# Altium schematic sheet MAIN_POWER.SchDoc: MAIN POWER & SUBSHEETS
size A3; Date: 2011-11-28; Author: S.Choquette; Revision: 2.0; SheetNumber: 1; SheetTotal: 9
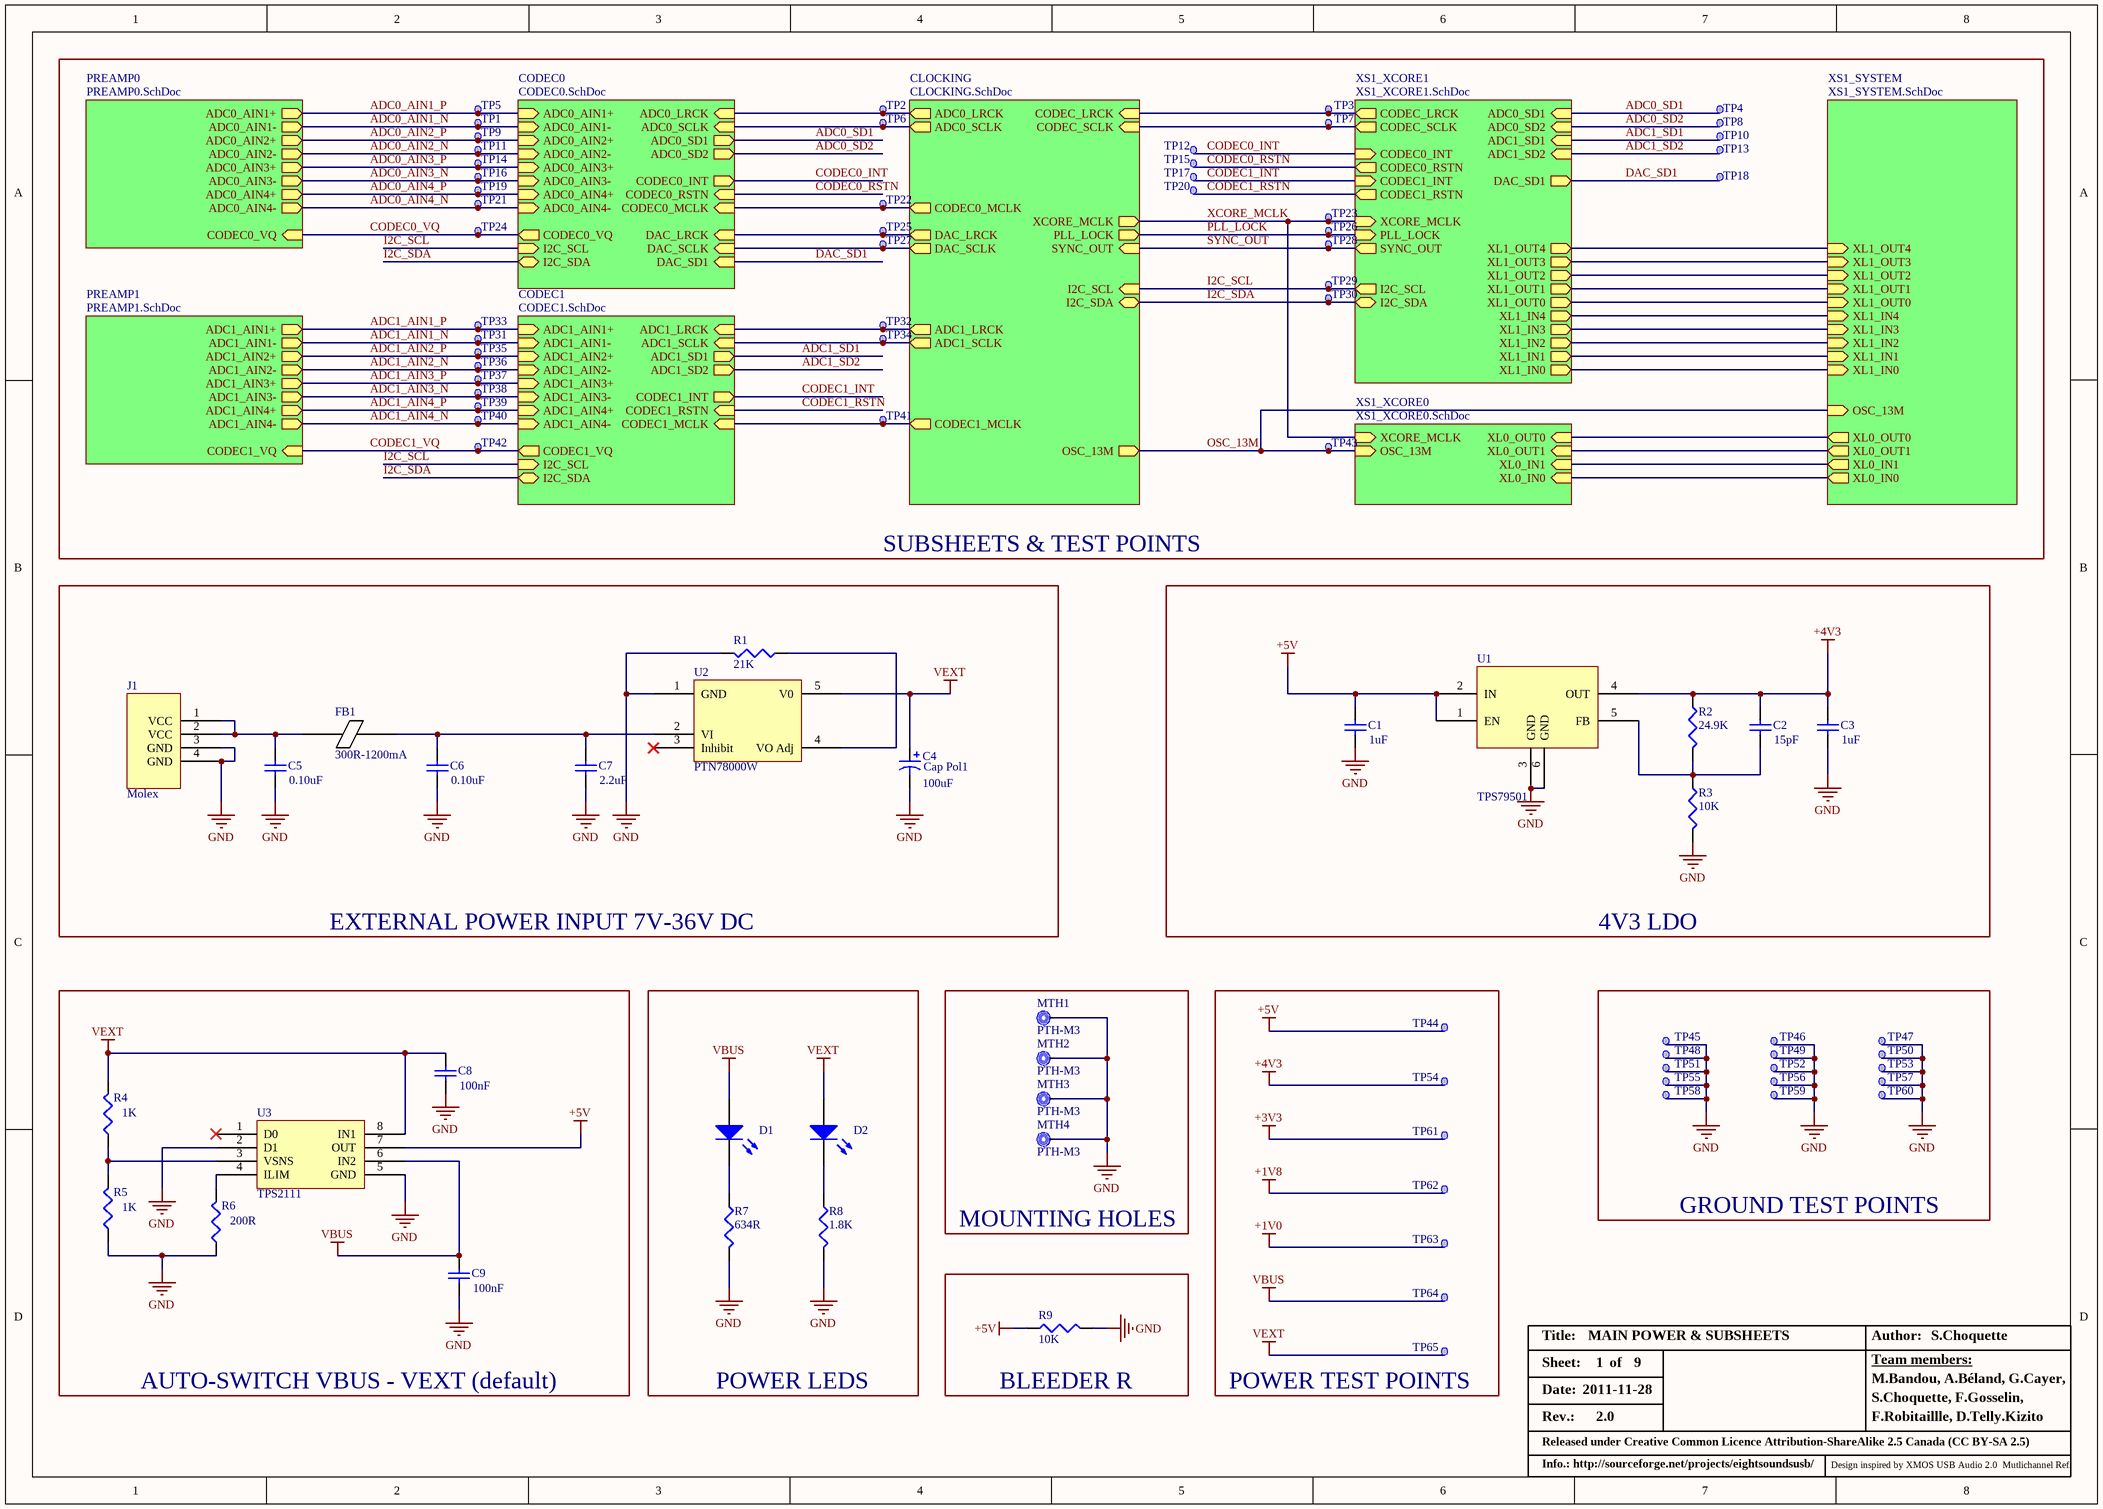
[diagram p0: MAIN_POWER.SchDoc]

## Parts
C1  value 1uF  [3-0603]
C2  value 15pF  [3-0603]
C3  value 1uF  [3-0603]
C4  Cap Pol1  value 100uF  [AL_ELEC_SMD_D]
C5  value 0.10uF  [3-0603]
C6  value 0.10uF  [3-0603]
C7  value 2.2uF  [8-1206]
C8  value 100nF  [3-0603]
C9  value 100nF  [3-0603]
D1  VBUS  [LED_0603]  (value not drawn)
D2  VEXT  [LED_0603]  (value not drawn)
FB1  300R-1200mA  [3-0603]
J1  Molex  [MOLEX-P4]
MTH1  PTH-M3  [Mounting Hole]
MTH2  PTH-M3  [Mounting Hole]
MTH3  PTH-M3  [Mounting Hole]
MTH4  PTH-M3  [Mounting Hole]
R1  value 21K  [3-0603]
R2  value 24.9K  [3-0603]
R3  value 10K  [3-0603]
R4  value 1K  [3-0603]
R5  value 1K  [3-0603]
R6  value 200R  [3-0603]
R7  value 634R  [3-0603]
R8  value 1.8K  [3-0603]
R9  value 10K  [3-0603]
TP1  TP  [TP]  (value not drawn)
TP2  TP  [TP]  (value not drawn)
TP3  TP  [TP]  (value not drawn)
TP4  TP  [TP]  (value not drawn)
TP5  TP  [TP]  (value not drawn)
TP6  TP  [TP]  (value not drawn)
TP7  TP  [TP]  (value not drawn)
TP8  TP  [TP]  (value not drawn)
TP9  TP  [TP]  (value not drawn)
TP10  TP  [TP]  (value not drawn)
TP11  TP  [TP]  (value not drawn)
TP12  TP  [TP]  (value not drawn)
TP13  TP  [TP]  (value not drawn)
TP14  TP  [TP]  (value not drawn)
TP15  TP  [TP]  (value not drawn)
TP16  TP  [TP]  (value not drawn)
TP17  TP  [TP]  (value not drawn)
TP18  TP  [TP]  (value not drawn)
TP19  TP  [TP]  (value not drawn)
TP20  TP  [TP]  (value not drawn)
TP21  TP  [TP]  (value not drawn)
TP22  TP  [TP]  (value not drawn)
TP23  TP  [TP]  (value not drawn)
TP24  TP  [TP]  (value not drawn)
TP25  TP  [TP]  (value not drawn)
TP26  TP  [TP]  (value not drawn)
TP27  TP  [TP]  (value not drawn)
TP28  TP  [TP]  (value not drawn)
TP29  TP  [TP]  (value not drawn)
TP30  TP  [TP]  (value not drawn)
TP31  TP  [TP]  (value not drawn)
TP32  TP  [TP]  (value not drawn)
TP33  TP  [TP]  (value not drawn)
TP34  TP  [TP]  (value not drawn)
TP35  TP  [TP]  (value not drawn)
TP36  TP  [TP]  (value not drawn)
TP37  TP  [TP]  (value not drawn)
TP38  TP  [TP]  (value not drawn)
TP39  TP  [TP]  (value not drawn)
TP40  TP  [TP]  (value not drawn)
TP41  TP  [TP]  (value not drawn)
TP42  TP  [TP]  (value not drawn)
TP43  TP  [TP]  (value not drawn)
TP44  TP  [TP]  (value not drawn)
TP45  TP  [TP]  (value not drawn)
TP46  TP  [TP]  (value not drawn)
TP47  TP  [TP]  (value not drawn)
TP48  TP  [TP]  (value not drawn)
TP49  TP  [TP]  (value not drawn)
TP50  TP  [TP]  (value not drawn)
TP51  TP  [TP]  (value not drawn)
TP52  TP  [TP]  (value not drawn)
TP53  TP  [TP]  (value not drawn)
TP54  TP  [TP]  (value not drawn)
TP55  TP  [TP]  (value not drawn)
TP56  TP  [TP]  (value not drawn)
TP57  TP  [TP]  (value not drawn)
TP58  TP  [TP]  (value not drawn)
TP59  TP  [TP]  (value not drawn)
TP60  TP  [TP]  (value not drawn)
TP61  TP  [TP]  (value not drawn)
TP62  TP  [TP]  (value not drawn)
TP63  TP  [TP]  (value not drawn)
TP64  TP  [TP]  (value not drawn)
TP65  TP  [TP]  (value not drawn)
U1  TPS79501  [SOT223-6L]
U2  PTN78000W  [PTN78000W]
U3  TPS2111  [TSOP65P640-8AL]

## Blocks framed on the sheet
SUBSHEETS & TEST POINTS: TP1-TP43
EXTERNAL POWER INPUT 7V-36V DC: C4-C7 FB1 J1 R1 U2
4V3 LDO: C1-C3 R2 R3 U1
AUTO-SWITCH VBUS - VEXT (default): C8 C9 R4-R6 U3
POWER LEDS: D1 D2 R7 R8
MOUNTING HOLES: MTH1-MTH4
POWER TEST POINTS: TP44 TP54 TP61-TP65
GROUND TEST POINTS: TP45-TP53 TP55-TP60
BLEEDER R: R9

## Sub-sheets
CLOCKING = CLOCKING.SchDoc: SYNC_OUT (in), CODEC0_MCLK (out), CODEC1_MCLK (out), I2C_SCL (in), I2C_SDA (bidir), PLL_LOCK (out), OSC_13M (out), CODEC_LRCK (in), CODEC_SCLK (in), ADC0_SCLK (out), ADC0_LRCK (out), DAC_SCLK (out), DAC_LRCK (out), XCORE_MCLK (out), ADC1_LRCK (out), ADC1_SCLK (out)
CODEC0 = CODEC0.SchDoc: ADC0_AIN1+ (in), ADC0_AIN1- (in), ADC0_AIN2+ (in), ADC0_AIN2- (in), ADC0_AIN3+ (in), ADC0_AIN3- (in), ADC0_AIN4+ (in), ADC0_AIN4- (in), CODEC0_VQ (out), ADC0_LRCK (in), ADC0_SCLK (in), ADC0_SD1 (out), ADC0_SD2 (out), CODEC0_INT (out), CODEC0_RSTN (in), CODEC0_MCLK (in), DAC_LRCK (in), DAC_SCLK (in), DAC_SD1 (in), I2C_SCL (in), I2C_SDA
CODEC1 = CODEC1.SchDoc: ADC1_AIN1+ (in), ADC1_AIN1- (in), ADC1_AIN2+ (in), ADC1_AIN2- (in), ADC1_AIN3+ (in), ADC1_AIN3- (in), ADC1_AIN4+ (in), ADC1_AIN4- (in), CODEC1_VQ (out), ADC1_LRCK (in), ADC1_SCLK (in), ADC1_SD1 (out), ADC1_SD2 (out), CODEC1_INT (out), CODEC1_RSTN (in), CODEC1_MCLK (in), I2C_SCL (in), I2C_SDA (bidir)
PREAMP0 = PREAMP0.SchDoc: ADC0_AIN1+ (out), ADC0_AIN1- (out), ADC0_AIN2+ (out), ADC0_AIN2- (out), ADC0_AIN3+ (out), ADC0_AIN3- (out), ADC0_AIN4+ (out), ADC0_AIN4- (out), CODEC0_VQ (in)
PREAMP1 = PREAMP1.SchDoc: ADC1_AIN1+ (out), ADC1_AIN1- (out), ADC1_AIN2+ (out), ADC1_AIN2- (out), ADC1_AIN3+ (out), ADC1_AIN3- (out), ADC1_AIN4+ (out), ADC1_AIN4- (out), CODEC1_VQ (in)
XS1_SYSTEM = XS1_SYSTEM.SchDoc: XL0_OUT1 (out), XL0_OUT0 (out), XL0_IN0 (out), XL0_IN1 (out), XL1_OUT4 (in), XL1_OUT3 (in), XL1_OUT2 (in), XL1_OUT1 (in), XL1_OUT0 (in), XL1_IN4 (in), XL1_IN3 (in), XL1_IN2 (in), XL1_IN1 (in), XL1_IN0 (in), OSC_13M (in)
XS1_XCORE0 = XS1_XCORE0.SchDoc: XL0_IN0 (in), XL0_IN1 (in), XL0_OUT1 (in), XL0_OUT0 (in), OSC_13M (in), XCORE_MCLK (in)
XS1_XCORE1 = XS1_XCORE1.SchDoc: CODEC_LRCK (out), CODEC_SCLK (out), CODEC0_INT (in), CODEC0_RSTN (out), CODEC1_INT (in), CODEC1_RSTN (out), XCORE_MCLK (in), PLL_LOCK (in), SYNC_OUT (out), ADC0_SD1 (in), ADC0_SD2 (in), ADC1_SD1 (in), ADC1_SD2 (in), DAC_SD1 (out), I2C_SCL (out), I2C_SDA (bidir), XL1_OUT4 (out), XL1_OUT3 (out), XL1_OUT2 (out), XL1_OUT1 (out), XL1_OUT0 (out), XL1_IN4 (out), XL1_IN3 (out), XL1_IN2 (out), XL1_IN1 (out), XL1_IN0 (out)

## Nets
+1V0: TP63.1
+1V8: TP62.1
+3V3: TP61.1
+4V3: C2.2 C3.2 R2.1 TP54.1 U1.4(OUT)
+5V: C1.2 R9.1 TP44.1 U1.1(EN) U1.2(IN) U3.7(OUT)
GND: C1.1 C3.1 C4.2 C5.1 C6.1 C7.1 C8.1 C9.1 J1.3(GND) J1.4(GND) MTH1.1 MTH2.1 MTH3.1 MTH4.1 R1.2 R3.2 R5.1 R6.1 R7.2 R8.2 R9.2 TP45.1 TP46.1 TP47.1 TP48.1 TP49.1 TP50.1 TP51.1 TP52.1 TP53.1 TP55.1 TP56.1 TP57.1 TP58.1 TP59.1 TP60.1 U1.3(GND) U1.6(GND) U2.1(GND) U3.2(D1) U3.5(GND)
VBUS: C9.2 D1.1(A) TP64.1 U3.6(IN2)
VEXT: C4.1 C8.2 D2.1(A) R4.2 TP65.1 U2.5(V0) U3.8(IN1)
ADC0_AIN1_N: TP1.1 ; sheet CODEC0/ADC0_AIN1-, sheet PREAMP0/ADC0_AIN1-
ADC0_AIN1_P: TP5.1 ; sheet CODEC0/ADC0_AIN1+, sheet PREAMP0/ADC0_AIN1+
ADC0_AIN2_N: TP11.1 ; sheet CODEC0/ADC0_AIN2-, sheet PREAMP0/ADC0_AIN2-
ADC0_AIN2_P: TP9.1 ; sheet CODEC0/ADC0_AIN2+, sheet PREAMP0/ADC0_AIN2+
ADC0_AIN3_N: TP16.1 ; sheet CODEC0/ADC0_AIN3-, sheet PREAMP0/ADC0_AIN3-
ADC0_AIN3_P: TP14.1 ; sheet CODEC0/ADC0_AIN3+, sheet PREAMP0/ADC0_AIN3+
ADC0_AIN4_N: TP21.1 ; sheet CODEC0/ADC0_AIN4-, sheet PREAMP0/ADC0_AIN4-
ADC0_AIN4_P: TP19.1 ; sheet CODEC0/ADC0_AIN4+, sheet PREAMP0/ADC0_AIN4+
ADC0_SD1: TP4.1 ; sheet CODEC0/ADC0_SD1, sheet XS1_XCORE1/ADC0_SD1
ADC0_SD2: TP8.1 ; sheet CODEC0/ADC0_SD2, sheet XS1_XCORE1/ADC0_SD2
ADC1_AIN1_N: TP31.1 ; sheet CODEC1/ADC1_AIN1-, sheet PREAMP1/ADC1_AIN1-
ADC1_AIN1_P: TP33.1 ; sheet CODEC1/ADC1_AIN1+, sheet PREAMP1/ADC1_AIN1+
ADC1_AIN2_N: TP36.1 ; sheet CODEC1/ADC1_AIN2-, sheet PREAMP1/ADC1_AIN2-
ADC1_AIN2_P: TP35.1 ; sheet CODEC1/ADC1_AIN2+, sheet PREAMP1/ADC1_AIN2+
ADC1_AIN3_N: TP38.1 ; sheet CODEC1/ADC1_AIN3-, sheet PREAMP1/ADC1_AIN3-
ADC1_AIN3_P: TP37.1 ; sheet CODEC1/ADC1_AIN3+, sheet PREAMP1/ADC1_AIN3+
ADC1_AIN4_N: TP40.1 ; sheet CODEC1/ADC1_AIN4-, sheet PREAMP1/ADC1_AIN4-
ADC1_AIN4_P: TP39.1 ; sheet CODEC1/ADC1_AIN4+, sheet PREAMP1/ADC1_AIN4+
ADC1_SD1: TP10.1 ; sheet CODEC1/ADC1_SD1, sheet XS1_XCORE1/ADC1_SD1
ADC1_SD2: TP13.1 ; sheet CODEC1/ADC1_SD2, sheet XS1_XCORE1/ADC1_SD2
CODEC0_INT: TP12.1 ; sheet CODEC0/CODEC0_INT, sheet XS1_XCORE1/CODEC0_INT
CODEC0_RSTN: TP15.1 ; sheet CODEC0/CODEC0_RSTN, sheet XS1_XCORE1/CODEC0_RSTN
CODEC0_VQ: TP24.1 ; sheet CODEC0/CODEC0_VQ, sheet PREAMP0/CODEC0_VQ
CODEC1_INT: TP17.1 ; sheet CODEC1/CODEC1_INT, sheet XS1_XCORE1/CODEC1_INT
CODEC1_RSTN: TP20.1 ; sheet CODEC1/CODEC1_RSTN, sheet XS1_XCORE1/CODEC1_RSTN
CODEC1_VQ: TP42.1 ; sheet CODEC1/CODEC1_VQ, sheet PREAMP1/CODEC1_VQ
DAC_SD1: TP18.1 ; sheet CODEC0/DAC_SD1, sheet XS1_XCORE1/DAC_SD1
I2C_SCL: TP29.1 ; sheet CLOCKING/I2C_SCL, sheet CODEC0/I2C_SCL, sheet CODEC1/I2C_SCL, sheet XS1_XCORE1/I2C_SCL
I2C_SDA: TP30.1 ; sheet CLOCKING/I2C_SDA, sheet CODEC0/I2C_SDA, sheet CODEC1/I2C_SDA, sheet XS1_XCORE1/I2C_SDA
OSC_13M: TP43.1 ; sheet CLOCKING/OSC_13M, sheet XS1_SYSTEM/OSC_13M, sheet XS1_XCORE0/OSC_13M
PLL_LOCK: TP26.1 ; sheet CLOCKING/PLL_LOCK, sheet XS1_XCORE1/PLL_LOCK
SYNC_OUT: TP28.1 ; sheet CLOCKING/SYNC_OUT, sheet XS1_XCORE1/SYNC_OUT
XCORE_MCLK: TP23.1 ; sheet CLOCKING/XCORE_MCLK, sheet XS1_XCORE0/XCORE_MCLK, sheet XS1_XCORE1/XCORE_MCLK
NetC2_1: C2.1 R2.2 R3.1 U1.5(FB)
NetC5_2: C5.2 FB1.2 J1.1(VCC) J1.2(VCC)
NetC6_2: C6.2 C7.2 FB1.1 U2.2(VI)
NetD1_2: D1.2(K) R7.1
NetD2_2: D2.2(K) R8.1
NetR1_1: R1.1 U2.4(VO_Adj)
NetR4_1: R4.1 R5.2 U3.3(VSNS)
NetR6_2: R6.2 U3.4(ILIM)
NetTP2_1: TP2.1 ; sheet CLOCKING/ADC0_LRCK, sheet CODEC0/ADC0_LRCK
NetTP3_1: TP3.1 ; sheet CLOCKING/CODEC_LRCK, sheet XS1_XCORE1/CODEC_LRCK
NetTP6_1: TP6.1 ; sheet CLOCKING/ADC0_SCLK, sheet CODEC0/ADC0_SCLK
NetTP7_1: TP7.1 ; sheet CLOCKING/CODEC_SCLK, sheet XS1_XCORE1/CODEC_SCLK
NetTP22_1: TP22.1 ; sheet CLOCKING/CODEC0_MCLK, sheet CODEC0/CODEC0_MCLK
NetTP25_1: TP25.1 ; sheet CLOCKING/DAC_LRCK, sheet CODEC0/DAC_LRCK
NetTP27_1: TP27.1 ; sheet CLOCKING/DAC_SCLK, sheet CODEC0/DAC_SCLK
NetTP32_1: TP32.1 ; sheet CLOCKING/ADC1_LRCK, sheet CODEC1/ADC1_LRCK
NetTP34_1: TP34.1 ; sheet CLOCKING/ADC1_SCLK, sheet CODEC1/ADC1_SCLK
NetTP41_1: TP41.1 ; sheet CLOCKING/CODEC1_MCLK, sheet CODEC1/CODEC1_MCLK
(unnamed): sheet XS1_SYSTEM/XL0_OUT1, sheet XS1_XCORE0/XL0_OUT1
(unnamed): sheet XS1_SYSTEM/XL0_OUT0, sheet XS1_XCORE0/XL0_OUT0
(unnamed): sheet XS1_SYSTEM/XL0_IN0, sheet XS1_XCORE0/XL0_IN0
(unnamed): sheet XS1_SYSTEM/XL0_IN1, sheet XS1_XCORE0/XL0_IN1
(unnamed): sheet XS1_SYSTEM/XL1_OUT4, sheet XS1_XCORE1/XL1_OUT4
(unnamed): sheet XS1_SYSTEM/XL1_OUT3, sheet XS1_XCORE1/XL1_OUT3
(unnamed): sheet XS1_SYSTEM/XL1_OUT2, sheet XS1_XCORE1/XL1_OUT2
(unnamed): sheet XS1_SYSTEM/XL1_OUT1, sheet XS1_XCORE1/XL1_OUT1
(unnamed): sheet XS1_SYSTEM/XL1_OUT0, sheet XS1_XCORE1/XL1_OUT0
(unnamed): sheet XS1_SYSTEM/XL1_IN4, sheet XS1_XCORE1/XL1_IN4
(unnamed): sheet XS1_SYSTEM/XL1_IN3, sheet XS1_XCORE1/XL1_IN3
(unnamed): sheet XS1_SYSTEM/XL1_IN2, sheet XS1_XCORE1/XL1_IN2
(unnamed): sheet XS1_SYSTEM/XL1_IN1, sheet XS1_XCORE1/XL1_IN1
(unnamed): sheet XS1_SYSTEM/XL1_IN0, sheet XS1_XCORE1/XL1_IN0

Not connected (* = marked no-connect by the designer): U2 3(Inhibit)*; U3 1(D0)*

## Notes on the sheet
- Title:
- Date:
- Sheet:
- of
- Author:
- Team members:
- M.Bandou, A.Béland, G.Cayer,
- Rev.:
- Released under Creative Common Licence Attribution-ShareAlike 2.5 Canada (CC BY-SA 2.5)
- S.Choquette, F.Gosselin,
- F.Robitaillle, D.Telly.Kizito
- Info.: http://sourceforge.net/projects/eightsoundsusb/
- Design inspired by XMOS USB Audio 2.0  Mutlichannel Ref.

## Library data of the parts
C1 C3 = Cap: MLCC 1uF 0603 X5R 10V; Manufacturer: Murata; Part Number: GRM188R61A105KA61; Cost: 0,005
C2 = Cap: MLCC 15pF 0603 C0G 50V; Manufacturer: Murata; Part Number: GRM1885C1H150JA01D; Cost: 0,005
C4 = Cap Pol1: Al Elec 100uF CaseD 16V; Manufacturer: Panasonic; Part Number: EEEFK1C101P; Cost: *
C5 C6 = Cap: MLCC 0.10uF 0603 X7R 50V; Manufacturer: Murata; Part Number: GRM188R71H104KA93D; Cost: 0,005
C7 = Cap: MLCC 2.2uF 1206 X7R 50V; Manufacturer: Murata; Part Number: GRM31CR71H225KA88L
C8 C9 = Cap: MLCC 100nF 0603 X7R 16V; Manufacturer: Murata; Part Number: GRM188R71C104KA01; Cost: 0,005
D1 D2 = LED2: LED, GREEN, 0603; Manufacturer: Kingbright; Part Number: APT1608CGCK; Publisher: Altium Limited
FB1 = 300R-1200mA: Ferrite 300R -1200mA; Part Number: BLM18SG331TN1D; Manufacturer: Murata
J1 = Component_1: Molex connector; Part Number: 0026013115; Manufacturer: Molex
MTH1-MTH4 = MountingHole
R1 = Res3: RES 21k 0603 1%; Manufacturer: ROHM; PArt Number: MCR03EZPFX2102; Cost: *
R2 = Res3: RES 24.9K 0603 1%; Manufacturer: ROHM; Part Number: MCR03EZPFX2493; Cost: *
R3 R9 = Res3: RES 10k 0603 1%; Manufacturer: ROHM; Part Number: MCR03EZPFX1002; Cost: *
R4 R5 = Res3: RES 1k 0603 1%; Manufacturer: ROHM; Part Number: MCR03EZPFX1001; Cost: *
R6 = Res3: RES 200R 0603 1%; Manufacturer: ROHM; PArt Number: MCR03EZPFX2000; Cost: *
R7 = Res3: RES 634R 0603 1%; Manufacturer: ROHM; Part Number: MCR03EZPFX6340; Cost: *
R8 = Res3: RES 1.8k 0603 1%; Manufacturer: ROHM; Part Number: MCR03EZPFX1801; Cost: *
U1 = TPS79501: ULTRALOW-NOISE, HIGH PSRR, FAST RF 500-mA LOW-DROPOUT LINEAR REGULATORS; Manufacturer: Texas instruments; Part Number: TPS79501DCQ
U2 = PTN78000: 1.5-A, Wide-Input Adjustable Switching Regulator; Manufacturer: Texas Instrument; Part Number: PTN78000W; Cost: *
U3 = TPS2111: Dual In/Single Out Autoswitching Power MUX; Manufacturer: Texas Instrument; Part Number: TPS2111; Cost: *